# EAGLE design skema (EAGLE 6.3)
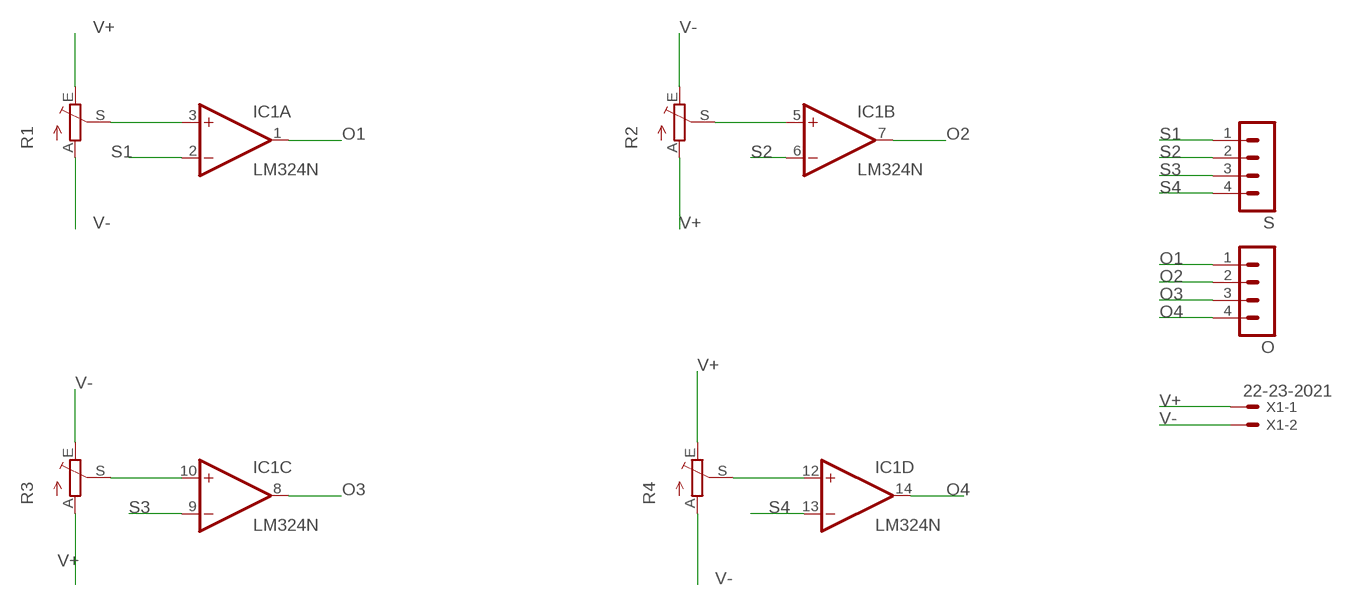
[diagram p0: schematic, sheet 1]

## Parts
IC1  LM324N  [DIL14]
O  MA04-1  [MA04-1]
R1  TRIM_EU-CA6V  [CA6V]
R2  TRIM_EU-CA6V  [CA6V]
R3  TRIM_EU-CA6V  [CA6V]
R4  TRIM_EU-CA6V  [CA6V]
S  MA04-1  [MA04-1]
X1  22-23-2021  [22-23-2021]

## Nets
N$1: IC1.3(A:+IN) R1.S
N$2: IC1.10(C:+IN) R3.S
N$3: IC1.5(B:+IN) R2.S
N$4: IC1.12(D:+IN) R4.S
O1: IC1.1(A:OUT) O.1
O2: IC1.7(B:OUT) O.2
O3: IC1.8(C:OUT) O.3
O4: IC1.14(D:OUT) O.4
S1: IC1.2(A:-IN) S.1
S2: IC1.6(B:-IN) S.2
S3: IC1.9(C:-IN) S.3
S4: IC1.13(D:-IN) S.4
V+: R1.E R2.A R3.A R4.E X1.1
V-: R1.A R2.E R3.E R4.A X1.2

## Power pins joined to a net without a drawn wire
V+: IC1.4(P:V+)
V-: IC1.11(P:V-)

## Library data of the parts
IC1 = linear:LM324: OP AMP
O S = con-lstb:MA04-1: PIN HEADER; OC_FARNELL: unknown; OC_NEWARK: unknown
R1-R4 = pot:TRIM_EU-: POTENTIOMETER
X1 = con-molex:22-23-2021: .100" (2.54mm) Center Header - 2 Pin; MF: MOLEX; MPN: 22-23-2021; OC_FARNELL: 1462926; OC_NEWARK: 25C3832

## Board
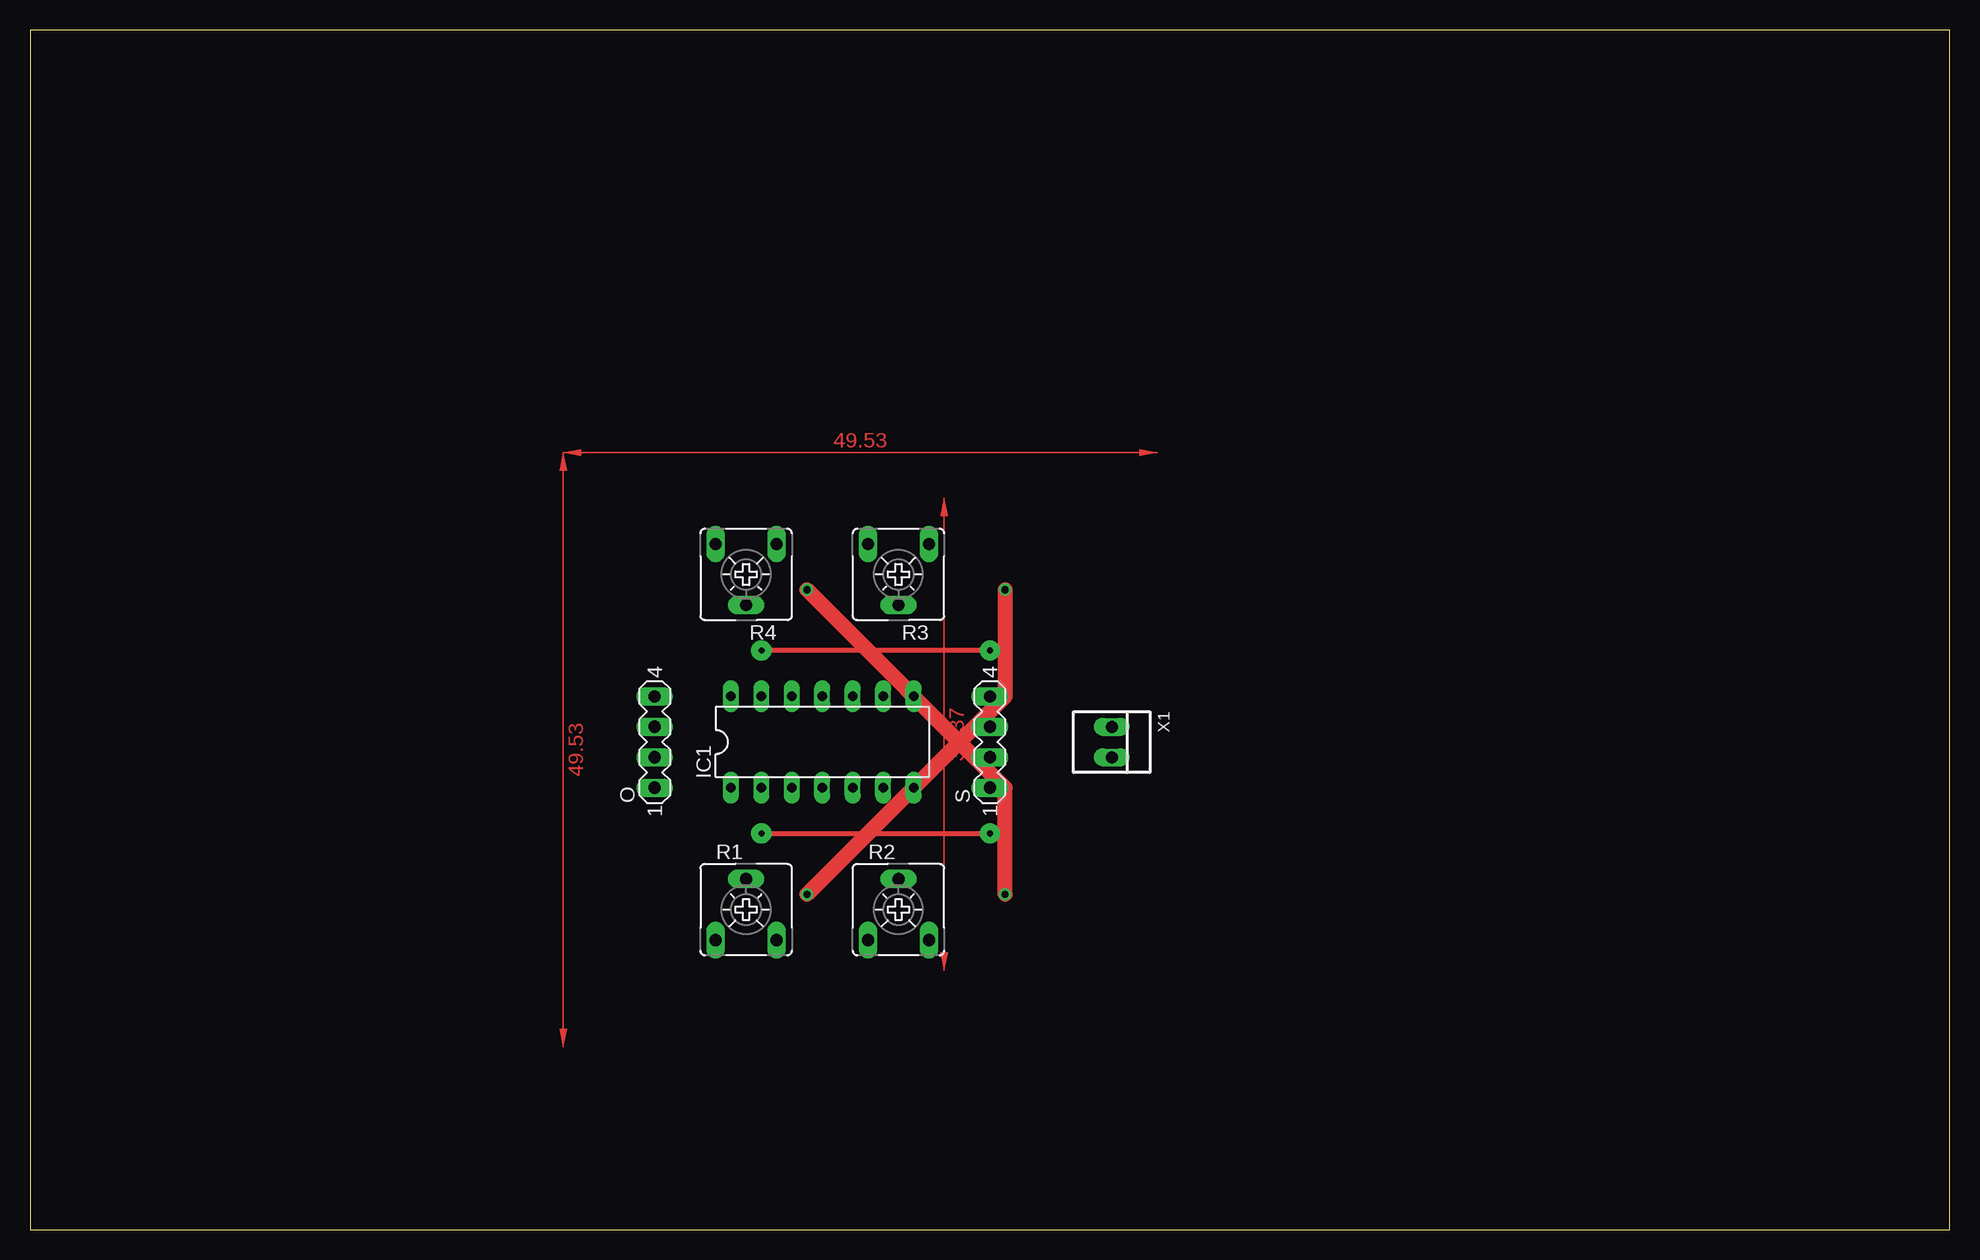
[diagram p1: board, top side]
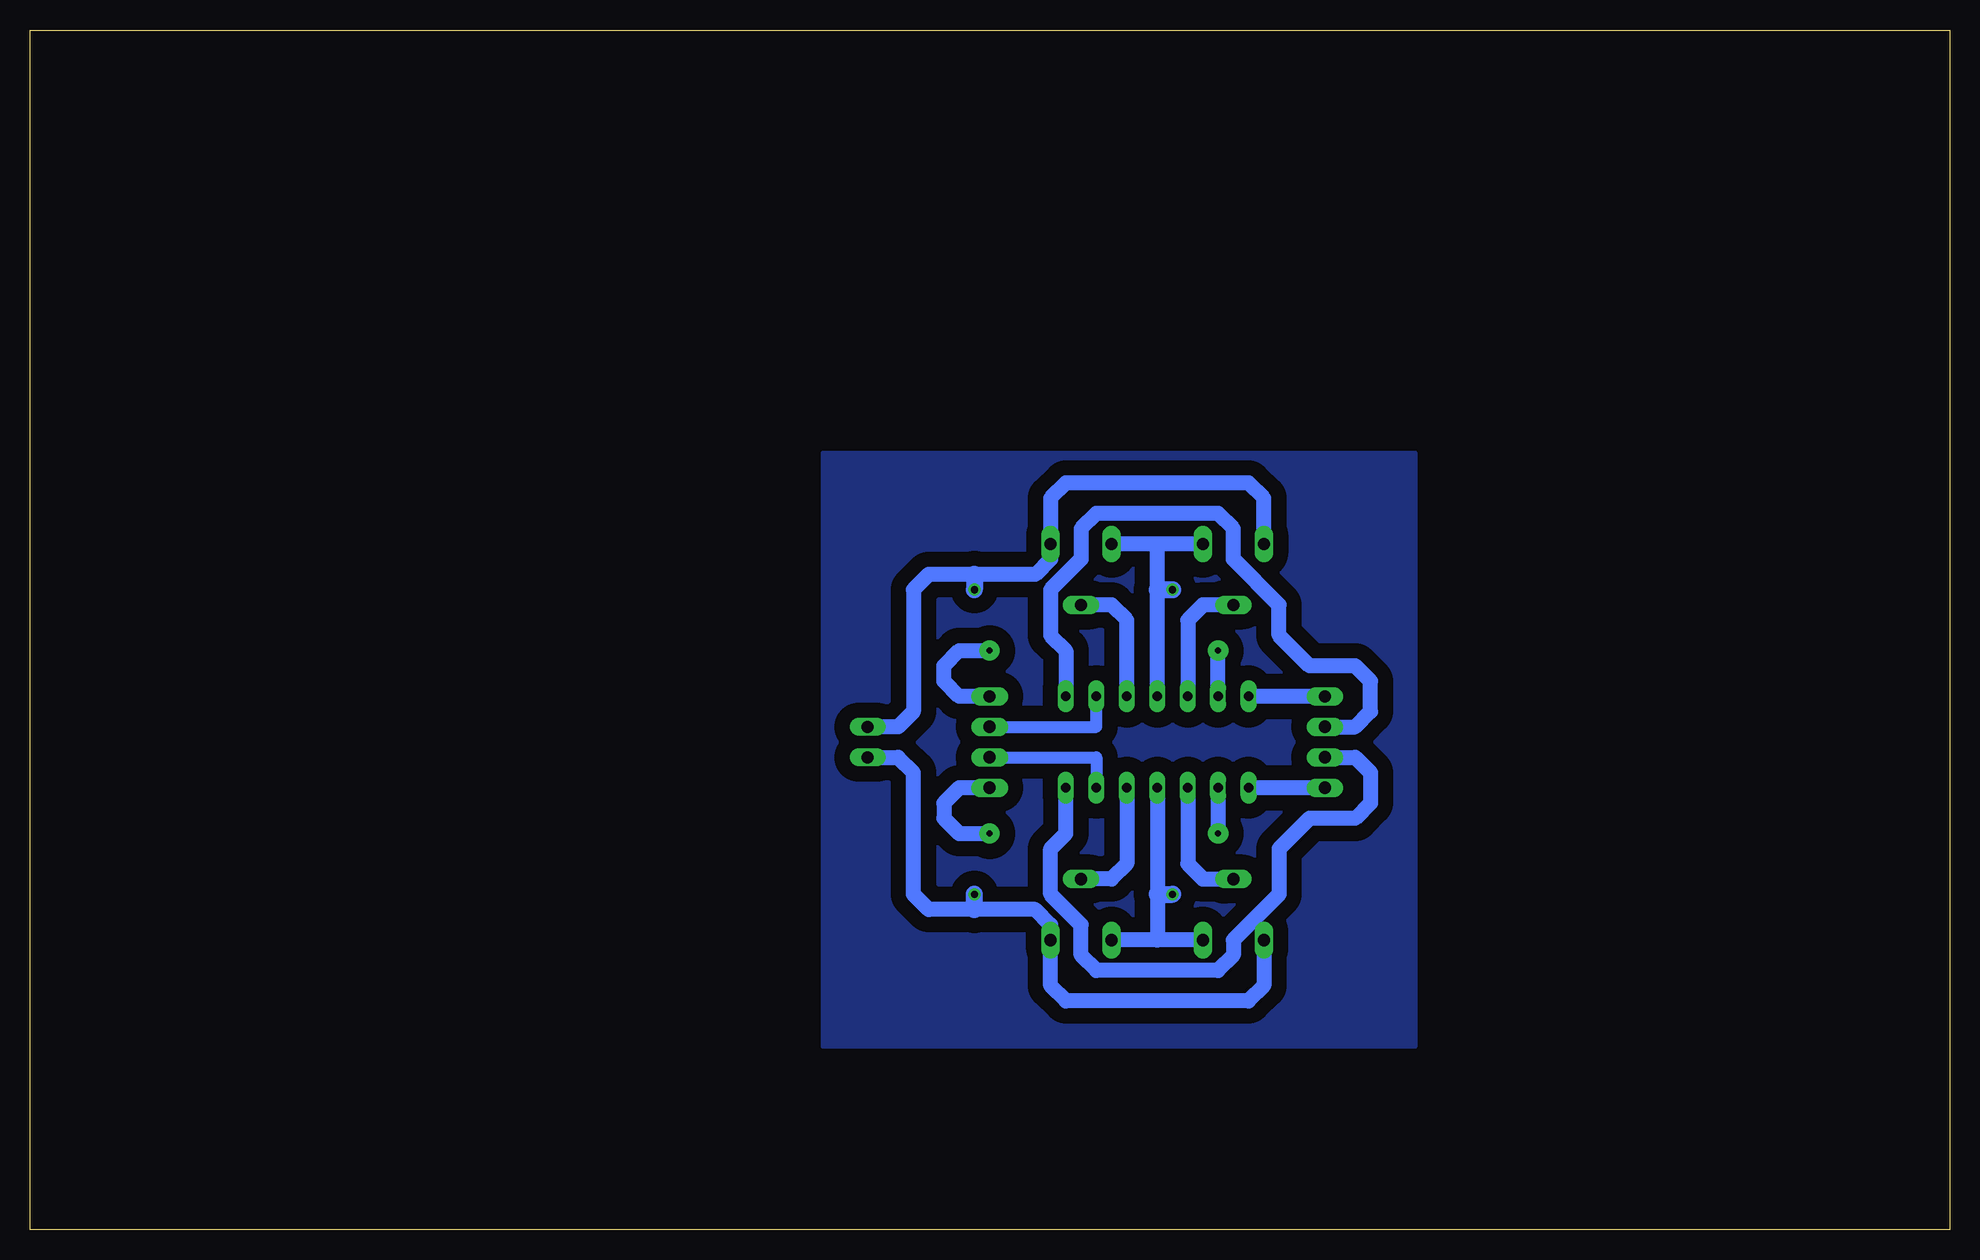
[diagram p2: board, bottom side, seen from below]

Size 160 x 100 mm. Coordinates in mm from the lower left corner, seen from the top.
Outline: 0,0 160,0 160,100 0,100 0,0
Copper layers (1*16): Top 0.035mm / dielectric 1.5mm / Bottom 0.035mm
Design rules "default *": minimum track width 10mil, minimum drill 24mil, track to track 50mil, track to pad 50mil, pad to pad 8mil, via to via 8mil, smd to smd 8mil, copper to edge 40mil, drill to drill 8mil, minimum pad ring 10mil, minimum via ring 8mil, stop-mask expansion 4mil, vias tented up to drill 0mil, thermal gap 10mil

### Footprints (pad centres in the part's own frame; a part is rotated, then mirrored left to right if it is on the bottom)
DIL14 = drill 0.813 long: 1 -7.62,-3.81; 2 -5.08,-3.81; 3 -2.54,-3.81; 4 0,-3.81; 5 2.54,-3.81; 6 5.08,-3.81; 7 7.62,-3.81; 8 7.62,3.81; 9 5.08,3.81; 10 2.54,3.81; 11 0,3.81; 12 -2.54,3.81; 13 -5.08,3.81; 14 -7.62,3.81
MA04-1 = drill 1.016 long: 1 -3.81,0; 2 -1.27,0; 3 1.27,0; 4 3.81,0
CA6V = drill 1.016 long: A -2.54,-2.54; E 2.54,-2.54; S 0,2.54
22-23-2021 = drill 1 long: 1 -1.27,0; 2 1.27,0

### Placement (x,y rotation side)
IC1  66.04,40.64 0 top
O  52.07,40.64 90 top
R1  59.69,26.67 0 top
R2  72.39,26.67 0 top
R3  72.39,54.61 180 top
R4  59.69,54.61 180 top
S  80.01,40.64 90 top
X1  90.17,40.64 270 top

### Tracks (layer width: path | path; a pad name or v marks a point on that pad's centre or on a via)
N$1
  Bottom 1.27: IC1.3 63.5,30.48 62.23,29.21 R1.S
N$2
  Bottom 1.27: IC1.10 68.58,50.8 69.85,52.07 R3.S
N$3
  Bottom 1.27: IC1.5 68.58,30.48 69.85,29.21 R2.S
N$4
  Bottom 1.27: R4.S 62.23,52.07 63.5,50.8 IC1.12
N$5
  pour Bottom: 44.45,15.24 44.45,64.77 93.98,64.77 93.98,15.24
O1
  Bottom 1.27: O.1 IC1.1
O2
  Bottom 1.27: O.2 49.53,39.37 48.26,38.1 48.26,35.56 49.53,34.29 53.34,34.29 55.88,31.75 55.88,27.94 59.69,24.13 59.69,22.86 60.96,21.59 71.12,21.59 72.39,22.86 72.39,25.4 74.93,27.94 74.93,31.75 73.66,33.02 IC1.7
O3
  Bottom 1.27: O.3 49.53,41.91 48.26,43.18 48.26,45.72 49.53,46.99 53.34,46.99 55.88,49.53 55.88,52.07 59.69,55.88 59.69,58.42 60.96,59.69 71.12,59.69 72.39,58.42 72.39,55.88 74.93,53.34 74.93,49.53 73.66,48.26 IC1.8
O4
  Bottom 1.27: O.4 IC1.14
S1  (via drill 0.5 pad 1.68)
  Top 0.406: v60.96,33.02 v80.01,33.02
  Bottom 1.27: S.1 82.55,36.83 83.82,35.56 83.82,34.29 82.55,33.02 v80.01,33.02 | IC1.2 v60.96,33.02
S2
  Bottom 1.016: S.2 71.12,39.37 IC1.6
S3
  Bottom 1.016: S.3 71.12,41.91 IC1.9
S4  (via drill 0.5 pad 1.68)
  Top 0.406: v80.01,48.26 v60.96,48.26
  Bottom 1.27: S.4 82.55,44.45 83.82,45.72 83.82,46.99 82.55,48.26 v80.01,48.26 | IC1.13 v60.96,48.26
V+  (via drill 0.6)
  Top 1.27: v81.28,53.34 81.28,44.45 v64.77,27.94
  Bottom 1.27: R4.E 57.15,60.96 58.42,62.23 73.66,62.23 74.93,60.96 R3.A 74.93,55.88 76.2,54.61 81.28,54.61 85.09,54.61 86.36,53.34 86.36,43.18 87.63,41.91 X1.1 | R1.E 66.04,24.13 | 66.04,24.13 R2.A | IC1.4 66.04,27.94 66.04,24.13
  Bottom 1.422: 66.04,27.94 v64.77,27.94 | 81.28,54.61 v81.28,53.34
V-  (via drill 0.6)
  Top 1.27: v81.28,27.94 81.28,36.83 v64.77,53.34
  Bottom 1.27: R4.A 66.04,57.15 | 66.04,57.15 R3.E | IC1.11 66.04,53.34 66.04,57.15 | R1.A 57.15,20.32 58.42,19.05 73.66,19.05 74.93,20.32 R2.E 74.93,25.4 76.2,26.67 81.28,26.67 85.09,26.67 86.36,27.94 86.36,38.1 87.63,39.37 X1.2
  Bottom 1.422: 66.04,53.34 v64.77,53.34 | 81.28,26.67 v81.28,27.94
(copper drawn outside any net)
  shapes: Top area x3